# Altium project LED_TwoBars.PrjPcb
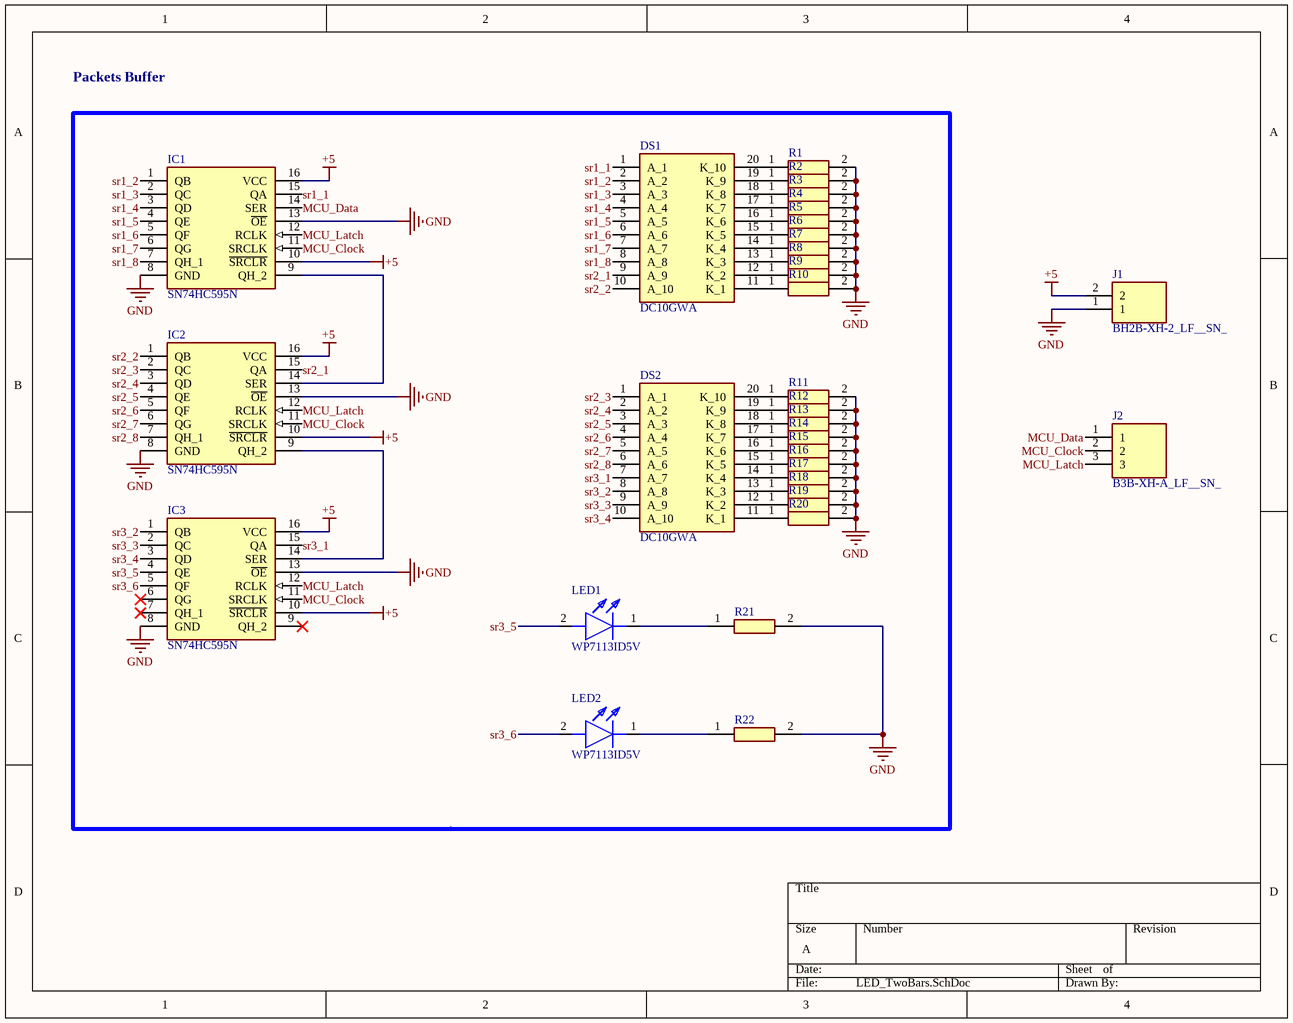
[diagram p0: LED_TwoBars.SchDoc]
1 sheet, 31 parts. Net scope: global (net labels, ports and power ports of the same name join across sheets).
Board file: LED_TwoBars.PcbDoc

## Sheet LED_TwoBars.SchDoc
size A; SheetNumber: 1; SheetTotal: 1

### Parts
DS1  DC10GWA  [DIPS750W75P254L2540H825Q20N]
DS2  DC10GWA  [DIPS750W75P254L2540H825Q20N]
IC1  SN74HC595N  [DIP794W53P254L1930H508Q16N]
IC2  SN74HC595N  [DIP794W53P254L1930H508Q16N]
IC3  SN74HC595N  [DIP794W53P254L1930H508Q16N]
J1  BH2B-XH-2_LF__SN_  [BH2BXH2LFSN]
J2  B3B-XH-A_LF__SN_  [B3BXHALFSN]
LED1  WP7113ID5V  [WP7113ID5V]
LED2  WP7113ID5V  [WP7113ID5V]
R1  330  [RESC3126X65N]  (value not drawn)
R2  RC1210FR-07330RL  [RESC3126X65N]  (value not drawn)
R3  330  [RESC3126X65N]  (value not drawn)
R4  RC1210FR-07330RL  [RESC3126X65N]  (value not drawn)
R5  330  [RESC3126X65N]  (value not drawn)
R6  RC1210FR-07330RL  [RESC3126X65N]  (value not drawn)
R7  330  [RESC3126X65N]  (value not drawn)
R8  RC1210FR-07330RL  [RESC3126X65N]  (value not drawn)
R9  330  [RESC3126X65N]  (value not drawn)
R10  330  [RESC3126X65N]  (value not drawn)
R11  330  [RESC3126X65N]  (value not drawn)
R12  330  [RESC3126X65N]  (value not drawn)
R13  330  [RESC3126X65N]  (value not drawn)
R14  330  [RESC3126X65N]  (value not drawn)
R15  330  [RESC3126X65N]  (value not drawn)
R16  330  [RESC3126X65N]  (value not drawn)
R17  330  [RESC3126X65N]  (value not drawn)
R18  330  [RESC3126X65N]  (value not drawn)
R19  RC1210FR-07330RL  [RESC3126X65N]  (value not drawn)
R20  330  [RESC3126X65N]  (value not drawn)
R21  330  [RESC3126X65N]  (value not drawn)
R22  330  [RESC3126X65N]  (value not drawn)

### Nets
+5: IC1.10(~{SRCLR}) IC1.16(VCC) IC2.10(~{SRCLR}) IC2.16(VCC) IC3.10(~{SRCLR}) IC3.16(VCC) J1.2
GND: IC1.8(GND) IC1.13(~{OE}) IC2.8(GND) IC2.13(~{OE}) IC3.8(GND) IC3.13(~{OE}) J1.1 R1.2 R2.2 R3.2 R4.2 R5.2 R6.2 R7.2 R8.2 R9.2 R10.2 R11.2 R12.2 R13.2 R14.2 R15.2 R16.2 R17.2 R18.2 R19.2 R20.2 R21.2 R22.2
MCU_Clock: IC1.11(SRCLK) IC2.11(SRCLK) IC3.11(SRCLK) J2.2
MCU_Data: IC1.14(SER) J2.1
MCU_Latch: IC1.12(RCLK) IC2.12(RCLK) IC3.12(RCLK) J2.3
sr1_1: DS1.1(A_1) IC1.15(QA)
sr1_2: DS1.2(A_2) IC1.1(QB)
sr1_3: DS1.3(A_3) IC1.2(QC)
sr1_4: DS1.4(A_4) IC1.3(QD)
sr1_5: DS1.5(A_5) IC1.4(QE)
sr1_6: DS1.6(A_6) IC1.5(QF)
sr1_7: DS1.7(A_7) IC1.6(QG)
sr1_8: DS1.8(A_8) IC1.7(QH_1)
sr2_1: DS1.9(A_9) IC2.15(QA)
sr2_2: DS1.10(A_10) IC2.1(QB)
sr2_3: DS2.1(A_1) IC2.2(QC)
sr2_4: DS2.2(A_2) IC2.3(QD)
sr2_5: DS2.3(A_3) IC2.4(QE)
sr2_6: DS2.4(A_4) IC2.5(QF)
sr2_7: DS2.5(A_5) IC2.6(QG)
sr2_8: DS2.6(A_6) IC2.7(QH_1)
sr3_1: DS2.7(A_7) IC3.15(QA)
sr3_2: DS2.8(A_8) IC3.1(QB)
sr3_3: DS2.9(A_9) IC3.2(QC)
sr3_4: DS2.10(A_10) IC3.3(QD)
sr3_5: IC3.4(QE) LED1.2(A)
sr3_6: IC3.5(QF) LED2.2(A)
NetDS1_11: DS1.11(K_1) R10.1
NetDS1_12: DS1.12(K_2) R9.1
NetDS1_13: DS1.13(K_3) R8.1
NetDS1_14: DS1.14(K_4) R7.1
NetDS1_15: DS1.15(K_5) R6.1
NetDS1_16: DS1.16(K_6) R5.1
NetDS1_17: DS1.17(K_7) R4.1
NetDS1_18: DS1.18(K_8) R3.1
NetDS1_19: DS1.19(K_9) R2.1
NetDS1_20: DS1.20(K_10) R1.1
NetDS2_11: DS2.11(K_1) R20.1
NetDS2_12: DS2.12(K_2) R19.1
NetDS2_13: DS2.13(K_3) R18.1
NetDS2_14: DS2.14(K_4) R17.1
NetDS2_15: DS2.15(K_5) R16.1
NetDS2_16: DS2.16(K_6) R15.1
NetDS2_17: DS2.17(K_7) R14.1
NetDS2_18: DS2.18(K_8) R13.1
NetDS2_19: DS2.19(K_9) R12.1
NetDS2_20: DS2.20(K_10) R11.1
NetIC1_9: IC1.9(QH_2) IC2.14(SER)
NetIC2_9: IC2.9(QH_2) IC3.14(SER)
NetLED1_1: LED1.1(K) R21.1
NetLED2_1: LED2.1(K) R22.1

Not connected (* = marked no-connect by the designer): IC3 6(QG)* 7(QH_1)* 9(QH_2)*

### Notes on the sheet
- Packets Buffer

### Library data of the parts
DS1 DS2 = DC10GWA: Display; Manufacturer_Name: Kingbright; Datasheet Link: http://www.us.kingbright.com/images/catalog/SPEC/DC10GWA.pdf; Height: 8.25mm; Manufacturer_Part_Number: DC10GWA; Mouser Part Number: 604-DC10GWA; Mouser Price/Stock: https://www.mouser.co.uk/ProductDetail/Kingbright/DC10GWA?qs=E09Sz5t5voWFSEBebdyzXA%3D%3D
IC1-IC3 = SN74HC595N: Integrated Circuit; Manufacturer_Name: Texas Instruments; Datasheet Link: http://www.ti.com/lit/ds/symlink/sn74hc595.pdf; Height: 5.08mm; Manufacturer_Part_Number: SN74HC595N; Mouser Part Number: 595-SN74HC595N; Mouser Price/Stock: https://www.mouser.co.uk/ProductDetail/Texas-Instruments/SN74HC595N?qs=IEl3ej0IqwBTHkYa8XPoMQ%3D%3D; Arrow Part Number: SN74HC595N; Arrow Price/Stock: https://www.arrow.com/en/products/sn74hc595n/texas-instruments?utm_currency=USD&region=nac
J1 = BH2B-XH-2_LF__SN_: Connector; Manufacturer_Name: JST (JAPAN SOLDERLESS TERMINALS); Manufacturer_Part_Number: BH2B-XH-2(LF)(SN); Datasheet Link: https://www.jst-mfg.com/product/pdf/eng/eXH-H.pdf; Height: 14.2mm; Arrow Part Number: BH2B-XH-2(LF)(SN); Arrow Price/Stock: https://www.arrow.com/en/products/bh2b-xh-2-lf-sn/jst-manufacturing?region=europe
J2 = B3B-XH-A_LF__SN_: Connector; Manufacturer_Name: JST (JAPAN SOLDERLESS TERMINALS); Manufacturer_Part_Number: B3B-XH-A(LF)(SN); Datasheet Link: https://datasheet.lcsc.com/szlcsc/1812131720_JST-Sales-America-B3B-XH-A-LF-SN_C144394.pdf; Height: 7mm; Mouser Part Number: 306-B3BXHALFSNP; Mouser Price/Stock: https://www.mouser.co.uk/ProductDetail/JST-Commercial/B3B-XH-ALFSN?qs=cdbOS8ANM9BVkoboCCIEMQ%3D%3D; Arrow Part Number: B3B-XH-A(LF)(SN); Arrow Price/Stock: https://www.arrow.com/en/products/b3b-xh-a-lf-sn/jst-manufacturing?utm_currency=USD&region=europe
LED1 LED2 = WP7113ID5V: LED; Manufacturer_Name: Kingbright; Datasheet Link: https://www.kingbrightusa.com/images/catalog/SPEC/WP7113ID5V.pdf; Height: 9.85mm; Manufacturer_Part_Number: WP7113ID5V; Mouser Part Number: 604-WP7113ID5V; Mouser Price/Stock: https://www.mouser.co.uk/ProductDetail/Kingbright/WP7113ID5V?qs=58z0TXQGVSQgkIxR0kd%2F5Q%3D%3D; Arrow Part Number: WP7113ID5V; Arrow Price/Stock: https://www.arrow.com/en/products/wp7113id5v/kingbright?utm_currency=USD&region=nac
R1-R22 = RC1210FR-07330RL: Resistor; Manufacturer_Name: Yageo Group; Datasheet Link: https://www.yageogroup.com/content/datasheet/asset/file/PYU-RC_GROUP_51_ROHS_L; Height: 0.65mm; Manufacturer_Part_Number: RC1210FR-07330RL